# Altium schematic sheet 0 Overview.SchDoc: Overview
size A3; PageSetup: Record=PageOptions|CenterHorizontal=True|CenterVertical=True|PrintScale=1.01|XCorrection=1.00|YCorrection=1.00|PrintKind=2|BorderSize=5000000|LeftOffset=0|BottomOffset=0|Orientation=2|PaperLength=1000|PaperWidth=1000|Scale=100|PaperSource=15|PrintQuality=600|MediaType=1|DitherType=10|PaperKind=A3|PrintScaleMode=1; DocumentNumber: 3; SheetNumber: 1; SheetTotal: 7
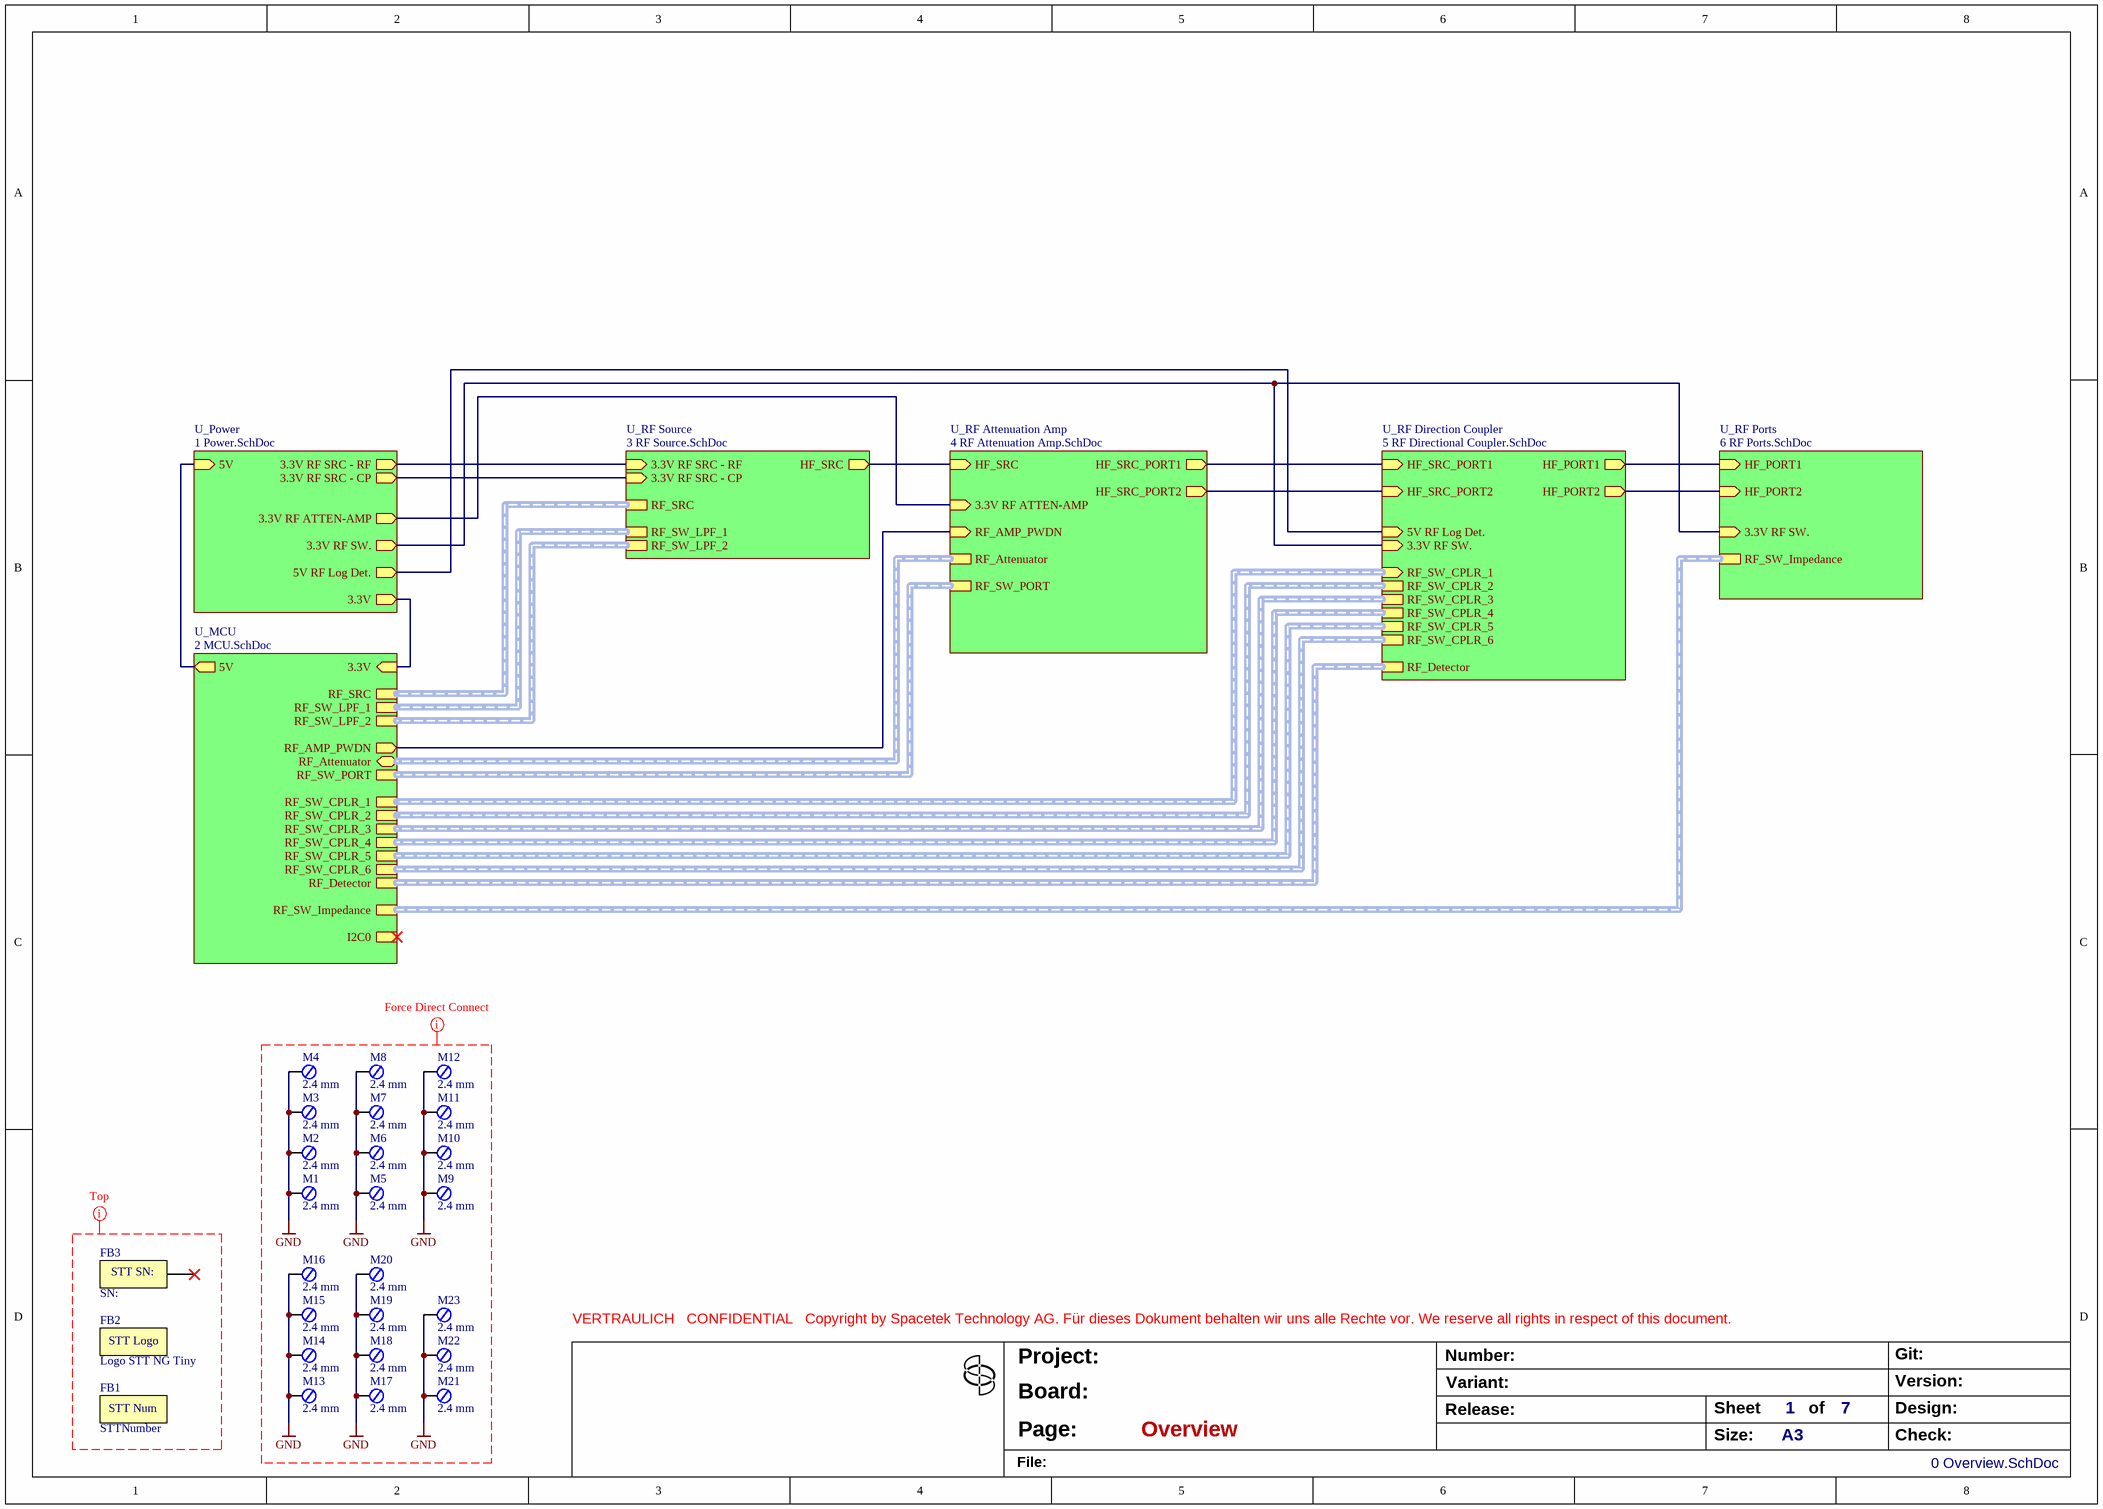
[diagram p0: 0 Overview.SchDoc]

## Parts
FB1  STTNumber  [STT--DO--STT-Number]  (no BOM)
FB2  Logo STT NG Tiny  [STT--DO--Logo-New]  (no BOM)
FB3  SN:  [STT--DO--SN]  (no BOM)
M1  2.4 mm  [STT--DO--Hole-2.4-3.0]  (no BOM)
M2  2.4 mm  [STT--DO--Hole-2.4-3.0]  (no BOM)
M3  2.4 mm  [STT--DO--Hole-2.4-3.0]  (no BOM)
M4  2.4 mm  [STT--DO--Hole-2.4-3.0]  (no BOM)
M5  2.4 mm  [STT--DO--Hole-2.4-3.0]  (no BOM)
M6  2.4 mm  [STT--DO--Hole-2.4-3.0]  (no BOM)
M7  2.4 mm  [STT--DO--Hole-2.4-3.0]  (no BOM)
M8  2.4 mm  [STT--DO--Hole-2.4-3.0]  (no BOM)
M9  2.4 mm  [STT--DO--Hole-2.4-3.0]  (no BOM)
M10  2.4 mm  [STT--DO--Hole-2.4-3.0]  (no BOM)
M11  2.4 mm  [STT--DO--Hole-2.4-3.0]  (no BOM)
M12  2.4 mm  [STT--DO--Hole-2.4-3.0]  (no BOM)
M13  2.4 mm  [STT--DO--Hole-2.4-3.0]  (no BOM)
M14  2.4 mm  [STT--DO--Hole-2.4-3.0]  (no BOM)
M15  2.4 mm  [STT--DO--Hole-2.4-3.0]  (no BOM)
M16  2.4 mm  [STT--DO--Hole-2.4-3.0]  (no BOM)
M17  2.4 mm  [STT--DO--Hole-2.4-3.0]  (no BOM)
M18  2.4 mm  [STT--DO--Hole-2.4-3.0]  (no BOM)
M19  2.4 mm  [STT--DO--Hole-2.4-3.0]  (no BOM)
M20  2.4 mm  [STT--DO--Hole-2.4-3.0]  (no BOM)
M21  2.4 mm  [STT--DO--Hole-2.4-3.0]  (no BOM)
M22  2.4 mm  [STT--DO--Hole-2.4-3.0]  (no BOM)
M23  2.4 mm  [STT--DO--Hole-2.4-3.0]  (no BOM)

## Sub-sheets
U_MCU = 2 MCU.SchDoc: 3.3V (in), 5V (out), RF_SRC (harness MAX2871), RF_SW_LPF_1 (harness RFSW6042), RF_SW_LPF_2 (harness RFSW6042), RF_Detector (harness AD8318SCPZ), RF_SW_CPLR_6 (harness RFSW6042), RF_SW_CPLR_5 (harness RFSW6042), RF_SW_CPLR_4 (harness RFSW6042), RF_SW_CPLR_3 (harness RFSW6042), RF_SW_CPLR_2 (harness RFSW6042), RF_SW_CPLR_1 (harness RFSW6042), RF_SW_PORT (harness QPC6324), RF_Attenuator (bidir, harness HMC1119LP4ME), RF_AMP_PWDN (out), RF_SW_Impedance (harness QPC6324), I2C0 (harness I2C)
U_Power = 1 Power.SchDoc: 5V RF Log Det. (out), 3.3V RF ATTEN-AMP (out), 3.3V RF SRC - RF (out), 5V (in), 3.3V (out), 3.3V RF SRC - CP (out), 3.3V RF SW. (out)
U_RF Attenuation Amp = 4 RF Attenuation Amp.SchDoc: HF_SRC (in), 3.3V RF ATTEN-AMP (in), RF_AMP_PWDN (in), RF_SW_PORT (harness QPC6324), RF_Attenuator (harness HMC1119LP4ME), HF_SRC_PORT1 (out), HF_SRC_PORT2 (out)
U_RF Direction Coupler = 5 RF Directional Coupler.SchDoc: HF_SRC_PORT1 (in), HF_SRC_PORT2 (in), HF_PORT1 (out), HF_PORT2 (out), RF_SW_CPLR_1 (in, harness RFSW6042), RF_SW_CPLR_2 (harness RFSW6042), RF_SW_CPLR_3 (harness RFSW6042), RF_SW_CPLR_4 (harness RFSW6042), RF_SW_CPLR_5 (harness RFSW6042), RF_SW_CPLR_6 (harness RFSW6042), RF_Detector (harness AD8318SCPZ), 3.3V RF SW. (in), 5V RF Log Det. (in)
U_RF Ports = 6 RF Ports.SchDoc: HF_PORT1 (in), HF_PORT2 (in), 3.3V RF SW. (in), RF_SW_Impedance (harness QPC6324)
U_RF Source = 3 RF Source.SchDoc: 3.3V RF SRC - RF (in), 3.3V RF SRC - CP (in), HF_SRC (out), RF_SRC (harness MAX2871), RF_SW_LPF_2 (harness RFSW6042), RF_SW_LPF_1 (harness RFSW6042)

## Nets
GND: M1.1 M2.1 M3.1 M4.1 M5.1 M6.1 M7.1 M8.1 M9.1 M10.1 M11.1 M12.1 M13.1 M14.1 M15.1 M16.1 M17.1 M18.1 M19.1 M20.1 M21.1 M22.1 M23.1
(unnamed): sheet U_Power/5V RF Log Det., sheet U_RF Direction Coupler/5V RF Log Det.
(unnamed): sheet U_Power/3.3V RF ATTEN-AMP, sheet U_RF Attenuation Amp/3.3V RF ATTEN-AMP
(unnamed): sheet U_Power/3.3V RF SRC - RF, sheet U_RF Source/3.3V RF SRC - RF
(unnamed): sheet U_Power/5V, sheet U_MCU/5V
(unnamed): sheet U_Power/3.3V, sheet U_MCU/3.3V
(unnamed): sheet U_Power/3.3V RF SRC - CP, sheet U_RF Source/3.3V RF SRC - CP
(unnamed): sheet U_Power/3.3V RF SW., sheet U_RF Direction Coupler/3.3V RF SW., sheet U_RF Ports/3.3V RF SW.
(unnamed): sheet U_MCU/RF_AMP_PWDN, sheet U_RF Attenuation Amp/RF_AMP_PWDN
(unnamed): sheet U_RF Source/HF_SRC, sheet U_RF Attenuation Amp/HF_SRC
(unnamed): sheet U_RF Attenuation Amp/HF_SRC_PORT1, sheet U_RF Direction Coupler/HF_SRC_PORT1
(unnamed): sheet U_RF Attenuation Amp/HF_SRC_PORT2, sheet U_RF Direction Coupler/HF_SRC_PORT2
(unnamed): sheet U_RF Direction Coupler/HF_PORT1, sheet U_RF Ports/HF_PORT1
(unnamed): sheet U_RF Direction Coupler/HF_PORT2, sheet U_RF Ports/HF_PORT2

Not connected (* = marked no-connect by the designer): FB3 1*

## Buses and harness runs
harness sheet U_MCU/RF_Attenuator = sheet U_RF Attenuation Amp/RF_Attenuator
harness sheet U_MCU/RF_Detector = sheet U_RF Direction Coupler/RF_Detector
harness sheet U_MCU/RF_SRC = sheet U_RF Source/RF_SRC
harness sheet U_MCU/RF_SW_CPLR_1 = sheet U_RF Direction Coupler/RF_SW_CPLR_1
harness sheet U_MCU/RF_SW_CPLR_2 = sheet U_RF Direction Coupler/RF_SW_CPLR_2
harness sheet U_MCU/RF_SW_CPLR_3 = sheet U_RF Direction Coupler/RF_SW_CPLR_3
harness sheet U_MCU/RF_SW_CPLR_4 = sheet U_RF Direction Coupler/RF_SW_CPLR_4
harness sheet U_MCU/RF_SW_CPLR_5 = sheet U_RF Direction Coupler/RF_SW_CPLR_5
harness sheet U_MCU/RF_SW_CPLR_6 = sheet U_RF Direction Coupler/RF_SW_CPLR_6
harness sheet U_MCU/RF_SW_Impedance = sheet U_RF Ports/RF_SW_Impedance
harness sheet U_MCU/RF_SW_LPF_1 = sheet U_RF Source/RF_SW_LPF_1
harness sheet U_MCU/RF_SW_LPF_2 = sheet U_RF Source/RF_SW_LPF_2
harness sheet U_MCU/RF_SW_PORT = sheet U_RF Attenuation Amp/RF_SW_PORT

## Layout directives
rule Permitted Layers Rule [Permitted Layers - Top,]: (no net found under the mark)
poly_direct_connect: true: GND

## Notes on the sheet
- VERTRAULICH   CONFIDENTIAL   Copyright by Spacetek Technology AG. Für dieses Dokument behalten wir uns alle Rechte vor. We reserve all rights in respect of this document.
- Project:
- Number:
- Variant:
- Version:
- Git:
- Board:
- Page:
- Release:
- Size:
- Sheet
- A3
- of
- Design:
- Check:
- File:
- (in symbol 800001-6) STT SN:
- (in symbol 800002-6) STT Num
- (in symbol CMP-042-000002-6) STT Logo

## Library data of the parts
FB1 = 800002-6: Fabrication Object STTNumber SMD--STTNumber; preferred: Yes; Type: Fabrication Object; Value: STTNumber; Partnumber: STTNumber; Status: active; Package: SMD--STTNumber
FB2 = CMP-042-000002-6: Fabrication Object Logo STT NG SMD--LOGO; A-Number: 800071; Type: Fabrication Object; Partnumber: Logo STT NG Tiny; Status: draft; Value: Logo STT NG Tiny; Package: SMD--LOGO
FB3 = 800001-6: Fabrication Object SN: SMD--SN; A-Number: 800001; preferred: Yes; Value: SN:; Status: active; Partnumber: SN:; Type: Fabrication Object; Package: SMD--SN
M1-M23 = 800035-1: Hole  THT--Hole 2.4 / 3.0; A-Number: 800035; preferred: Yes; Type: Hole; Value: 2.4 mm; Package: THT--Hole; Status: released; Special: 2.4 / 3.0